# EAGLE schematic 1000xopamp (EAGLE 5.11)
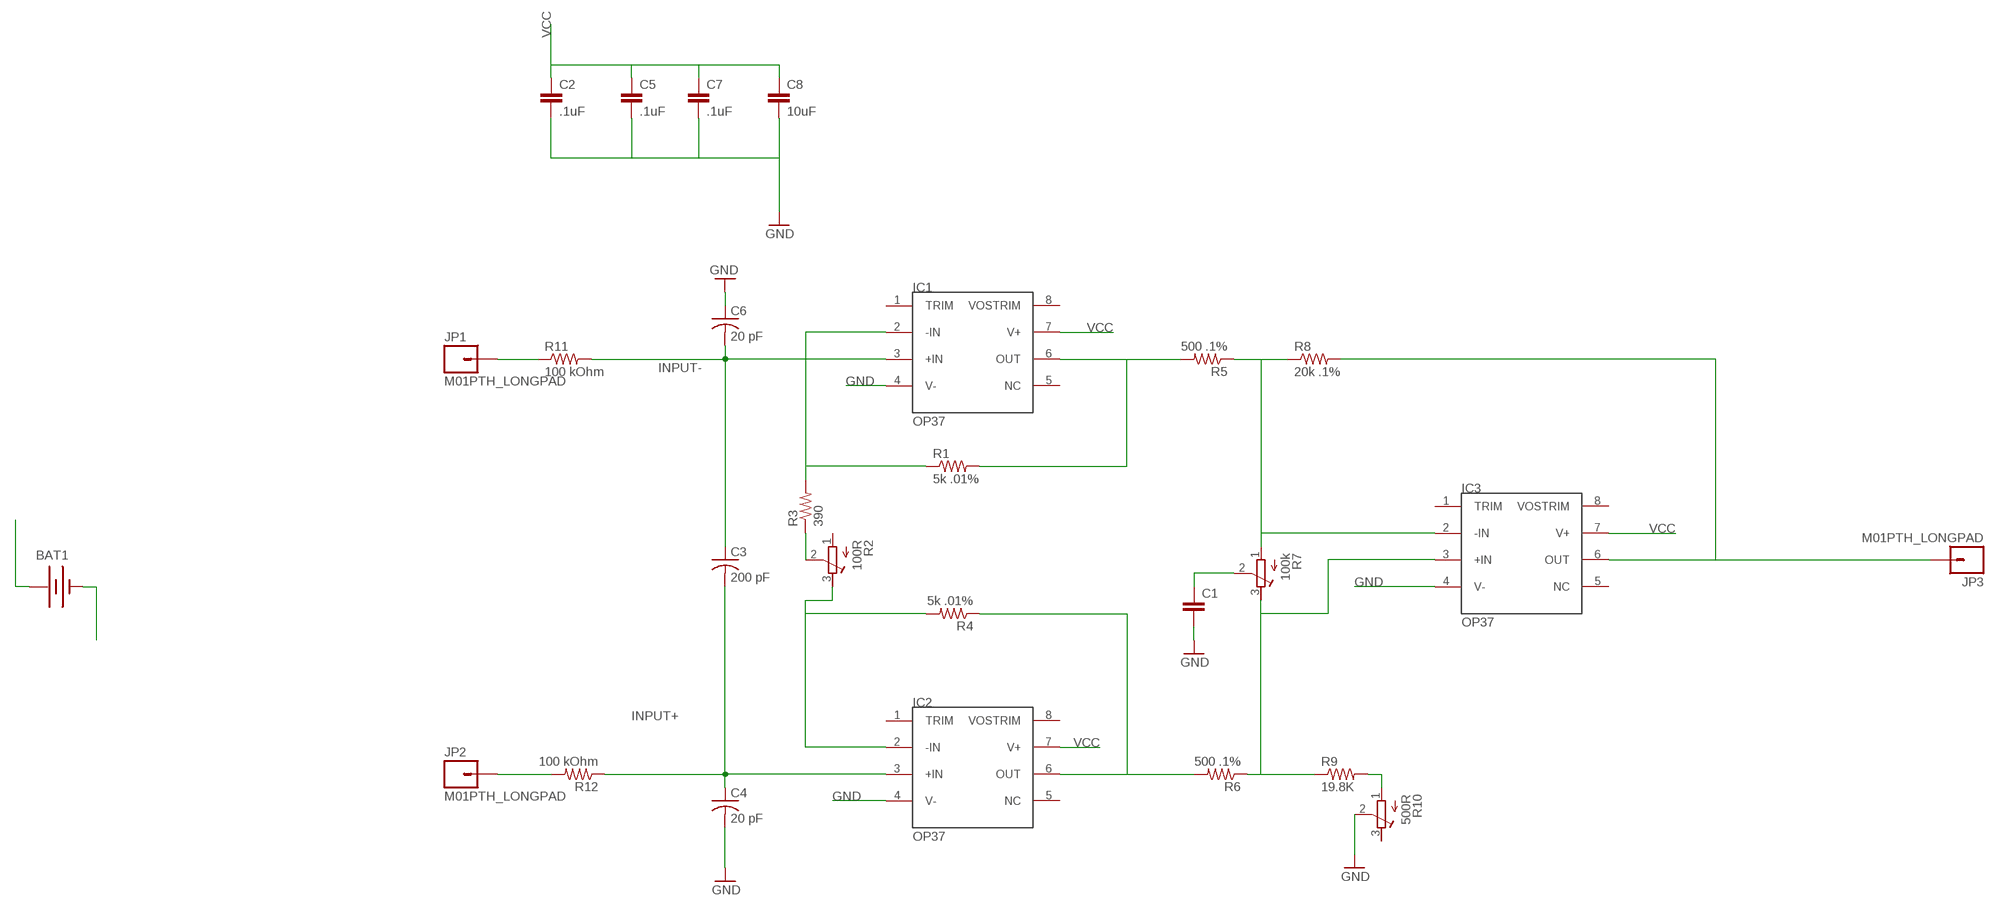
[diagram p0: schematic, sheet 1]

## Parts
BAT1  BATTERY20SMD  [BATTCON_20MM]
C1  CAP0805  [0805]
C2  .1uF  CAP0805  [0805]
C3  200 pF  C-USC0603  [C0603]
C4  20 pF  C-USC0603  [C0603]
C5  .1uF  CAP0805  [0805]
C6  20 pF  C-USC0603  [C0603]
C7  .1uF  CAP0805  [0805]
C8  10uF  CAP0805  [0805]
IC1  OP37  [SO08]
IC2  OP37  [SO08]
IC3  OP37  [SO08]
JP1  M01PTH_LONGPAD  [1X01_LONGPAD]
JP2  M01PTH_LONGPAD  [1X01_LONGPAD]
JP3  M01PTH_LONGPAD  [1X01_LONGPAD]
R1  5k .01%  RESISTOR  [0805]
R2  100R  R-TRIMM3224W  [RTRIM3224W]
R3  390  RESISTOR  [0805]
R4  5k .01%  RESISTOR  [0805]
R5  500 .1%  RESISTOR  [0805]
R6  500 .1%  RESISTOR  [0805]
R7  100k  R-TRIMM3224W  [RTRIM3224W]
R8  20k .1%  RESISTOR  [0805]
R9  19.8K  RESISTOR  [0805]
R10  500R  R-TRIMM3224W  [RTRIM3224W]
R11  100 kOhm  R-US_R0603  [R0603]
R12  100 kOhm  R-US_R0603  [R0603]

## Nets
GND: BAT1.2(-) C1.2 C2.2 C4.2 C5.2 C6.1 C7.2 C8.2 IC1.4(V-) IC2.4(V-) IC3.4(V-) R10.2(S)
INPUT+: C3.2 C4.1 IC2.3(+IN) R12.1
INPUT-: C3.1 C6.2 IC1.3(+IN) R11.2
N$1: IC1.2(-IN) R1.1 R3.2
N$2: IC2.2(-IN) R2.3(A) R4.2
N$3: R2.2(S) R3.1
N$4: IC2.6(OUT) R4.1 R6.2
N$5: IC1.6(OUT) R1.2 R5.2
N$6: IC3.2(-IN) R5.1 R7.1(E) R8.1
N$7: IC3.3(+IN) R6.1 R7.3(A) R9.1
N$8: C1.1 R7.2(S)
N$9: JP2.1 R12.2
N$10: IC3.6(OUT) JP3.1 R8.2
N$11: R9.2 R10.1(E)
N$12: JP1.1 R11.1
VCC: BAT1.1(+) C2.1 C5.1 C7.1 C8.1 IC1.7(V+) IC2.7(V+) IC3.7(V+)
Unconnected: IC1.1(TRIM) IC1.5(NC) IC1.8(VOSTRIM) IC2.1(TRIM) IC2.5(NC) IC2.8(VOSTRIM) IC3.1(TRIM) IC3.5(NC) IC3.8(VOSTRIM) R2.1(E) R10.3(A)

## Library data of the parts
BAT1 = SparkFun:BATTERY: Battery Holders Various common sizes : AA, AAA, 20mm coin cell and 12mm coin cell.
C1 = SparkFun:CAP: Capacitor Standard 0603 ceramic capacitor, and 0.1" leaded capacitor.
C2 C5 C7 C8 = 8x8:CAP: Capacitor Standard 0603 ceramic capacitor, and 0.1" leaded capacitor.
C3 C4 C6 = resistor:C-US: CAPACITOR, American symbol
IC1-IC3 = 1000xopamp:OP37
JP1-JP3 = SparkFun:M01: Header 1 Standard 1-pin 0.1" header. Use with straight break away headers (SKU : PRT-00116), right angle break away headers (PRT-00553), swiss pins (PRT-00743), machine pins (PRT-00117), and female headers (PRT-00115).
R1 R3-R6 R8 R9 = TVbNull-Laser:RESISTOR: Resistor Basic schematic elements and footprints for 0603, 1206, and PTH 1/10th watt (small) resistors.
R2 R7 R10 = rcl:R-TRIMM: Trimm resistor
R11 R12 = resistor:R-US_: RESISTOR, American symbol